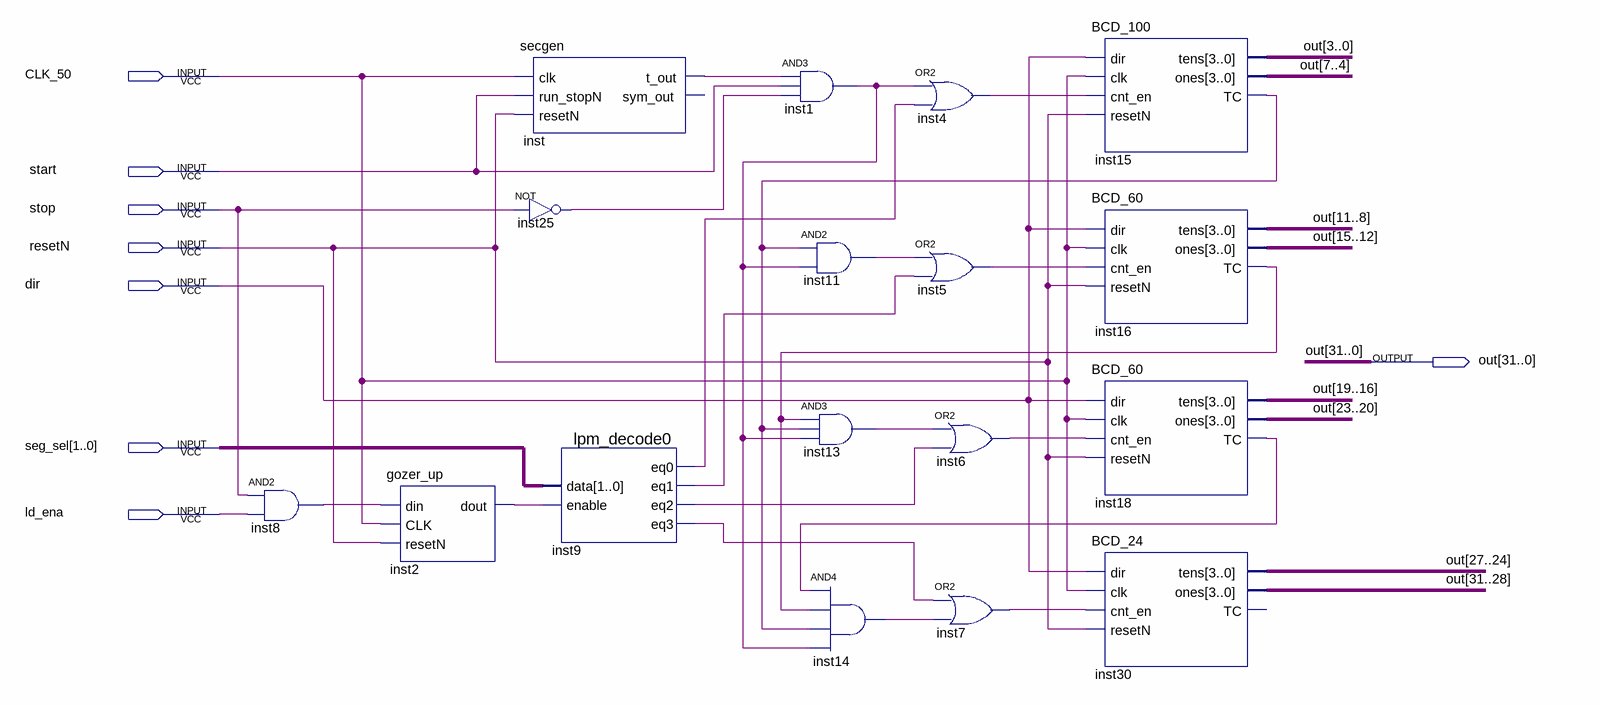
[diagram p0: schematic sheet]
// Quartus schematic stopper.bdf as structural Verilog: 17 symbols, 8 pins
module stopper (
  input  CLK_50,
  input  start,
  input  stop,
  input  resetN,
  input  dir,
  input  [1:0] seg_sel,
  input  ld_ena,
  output [31:0] out
);

  wire inst1_out, inst2_dout, inst4_out, inst5_out, inst6_out, inst7_out, inst8_out, inst9_eq0, inst9_eq1,
       inst9_eq2, inst9_eq3, inst11_out, inst13_out, inst14_out, inst15_tc, inst16_tc, inst18_tc, inst25_out,
       inst_t_out;

  and inst8 (inst8_out, stop, ld_ena);
  gozer_up inst2 (.din(inst8_out), .CLK(CLK_50), .resetN(resetN), .dout(inst2_dout));
  secgen inst (.clk(CLK_50), .run_stopN(start), .resetN(resetN), .t_out(inst_t_out));  // open: sym_out
  not inst25 (inst25_out, stop);
  lpm_decode0 inst9 (
    .data(seg_sel), .enable(inst2_dout), .eq0(inst9_eq0), .eq1(inst9_eq1), .eq2(inst9_eq2), .eq3(inst9_eq3));
  and inst1 (inst1_out, inst_t_out, start, inst25_out);
  and inst11 (inst11_out, inst15_tc, inst1_out);
  and inst13 (inst13_out, inst16_tc, inst15_tc, inst1_out);
  and inst14 (inst14_out, inst18_tc, inst16_tc, inst15_tc, inst1_out);
  or inst4 (inst4_out, inst1_out, inst9_eq0);
  or inst5 (inst5_out, inst11_out, inst9_eq1);
  or inst6 (inst6_out, inst13_out, inst9_eq2);
  or inst7 (inst7_out, inst9_eq3, inst14_out);
  BCD_100 inst15 (
    .dir(dir), .clk(CLK_50), .cnt_en(inst4_out), .resetN(resetN), .tens(out[3:0]), .ones(out[7:4]),
    .TC(inst15_tc));
  BCD_60 inst16 (
    .dir(dir), .clk(CLK_50), .cnt_en(inst5_out), .resetN(resetN), .tens(out[11:8]), .ones(out[15:12]),
    .TC(inst16_tc));
  BCD_60 inst18 (
    .dir(dir), .clk(CLK_50), .cnt_en(inst6_out), .resetN(resetN), .tens(out[19:16]), .ones(out[23:20]),
    .TC(inst18_tc));
  BCD_24 inst30 (
    .dir(dir), .clk(CLK_50), .cnt_en(inst7_out), .resetN(resetN), .tens(out[27:24]), .ones(out[31:28]));  // open: TC
endmodule
